# Altium schematic sheet Ethernet_bridge(BOT).SchDoc
size 900 x 699 mm; SheetNumber: 1; SheetTotal: 1; SPICEModelCacheNLVBOJOE: <root> / <DocumentId>NLVBOJOE</DocumentId> / </root>
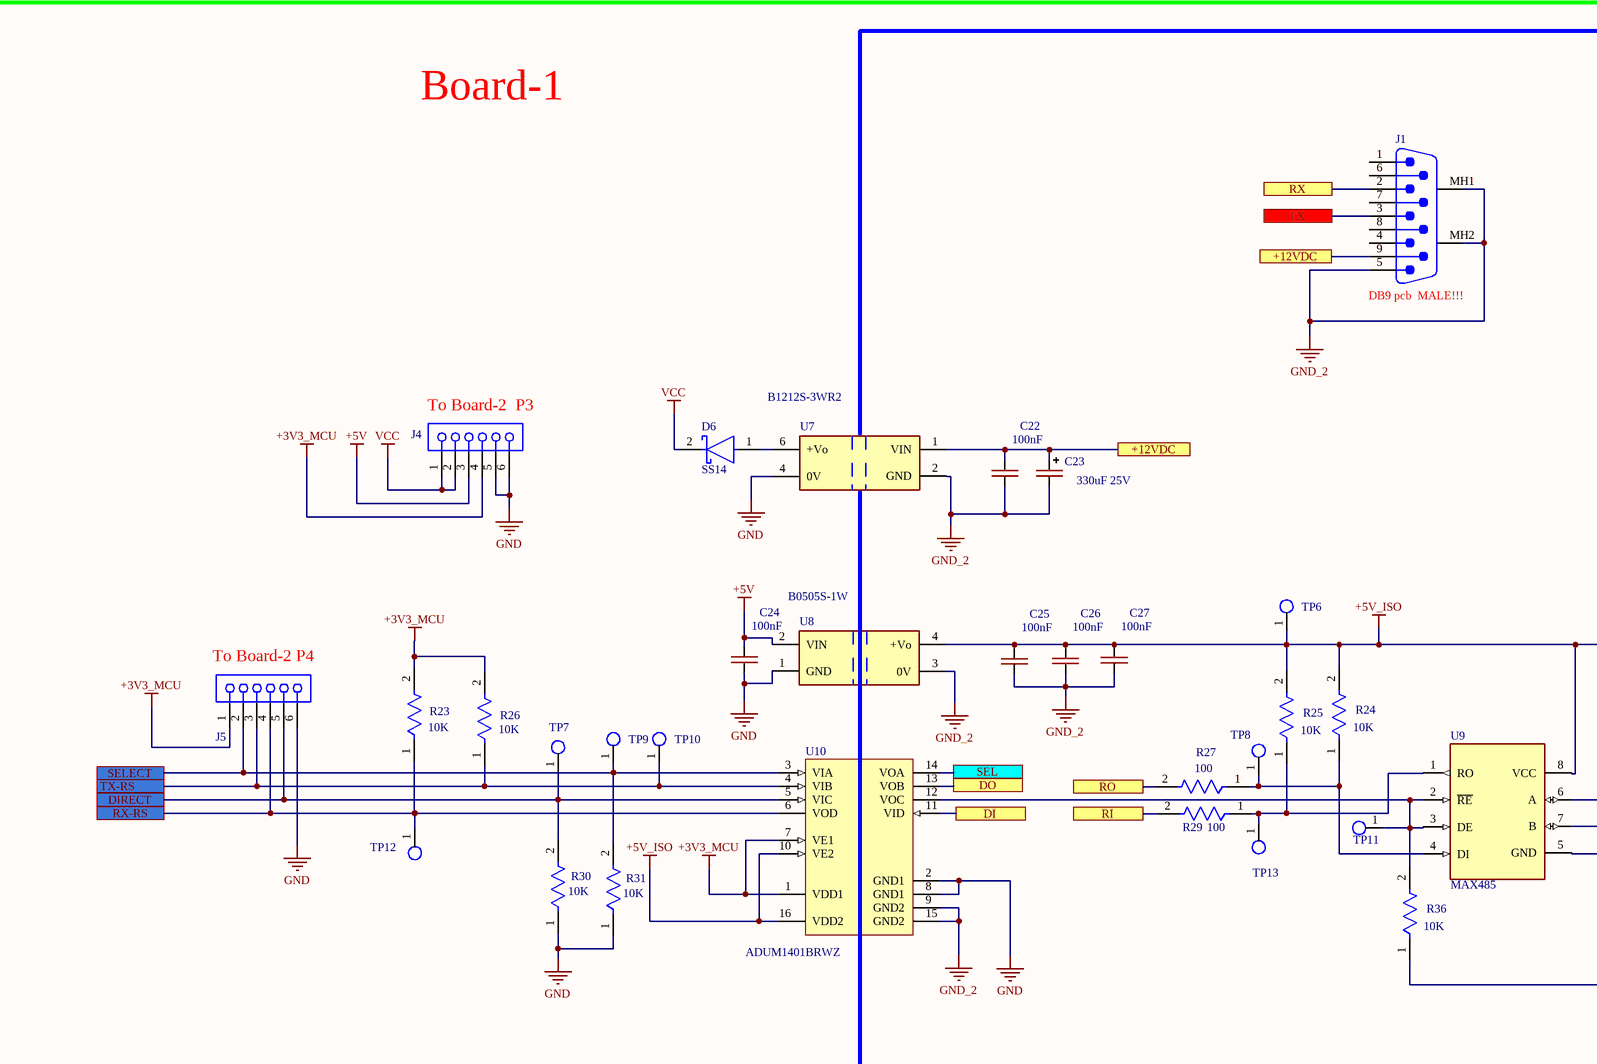
[diagram p0: Ethernet_bridge(BOT).SchDoc, left]
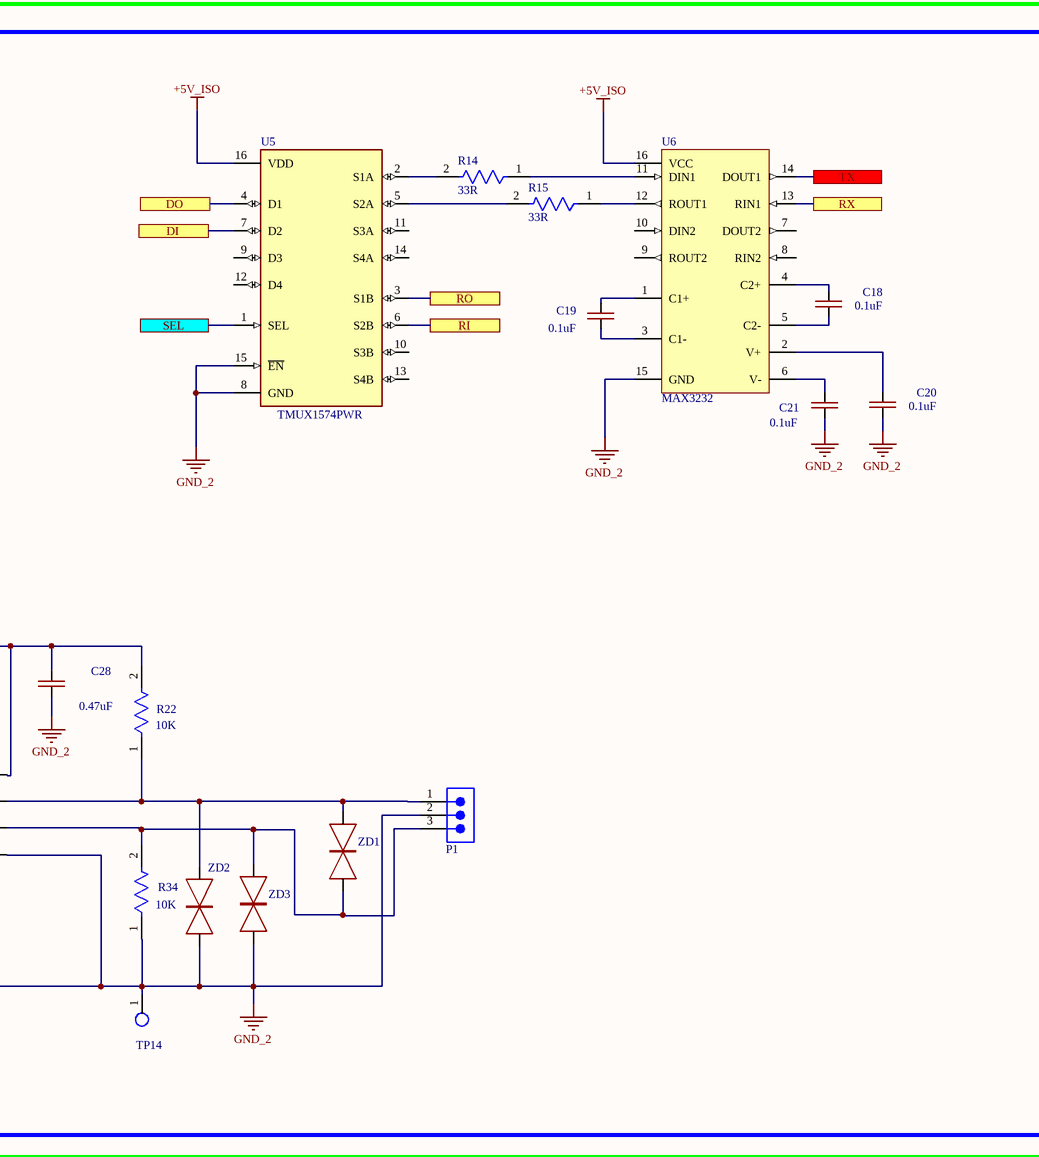
[diagram p1: Ethernet_bridge(BOT).SchDoc, right]

## Parts
C18  0.1uF  [CAP-0603]
C19  0.1uF  [CAP-0603]
C20  0.1uF  [CAP-0603]
C21  0.1uF  [CAP-0603]
C22  100nF  [CAP-0603]
C23  330uF 25V  [CAP_SMD_Size_E]
C24  100nF  [CAP-0603]
C25  100nF  [CAP-0603]
C26  100nF  [CAP-0603]
C27  100nF  [CAP-0603]
C28  0.47uF  [CAP-0805]
D6  SS14  [DO-214-AC]
J1  DB9 pcb  MALE!!!  [DB-9_2]
J4  61300611821  [61300611821]  (value not drawn)
J5  61300611821  [61300611821]  (value not drawn)
P1  691305340003  [691305340003]  (value not drawn)
R14  33R  [RES-0603]
R15  33R  [RES-0603]
R22  10K  [RES-0603]
R23  10K  [RES-0603]
R24  10K  [RES-0603]
R25  10K  [RES-0603]
R26  10K  [RES-0603]
R27  100  [RES-0603]
R29  100  [RES-0603]
R30  10K  [RES-0603]
R31  10K  [RES-0603]
R34  10K  [RES-0603]
R36  10K  [RES-0603]
TP6  Test_Point_PCB  [Test_Point]  (value not drawn)
TP7  Test_Point_PCB  [Test_Point]  (value not drawn)
TP8  Test_Point_PCB  [Test_Point]  (value not drawn)
TP9  Test_Point_PCB  [Test_Point]  (value not drawn)
TP10  Test_Point_PCB  [Test_Point]  (value not drawn)
TP11  Test_Point_PCB  [Test_Point]  (value not drawn)
TP12  Test_Point_PCB  [Test_Point]  (value not drawn)
TP13  (no value)  [Test_Point]
TP14  Test_Point_PCB  [Test_Point]  (value not drawn)
U5  TMUX1574PWR  [TSSOP-16-A]
U6  MAX3232  [SOIC-16-M]
U7  B1212S-3WR2  [B1212S-3WR2]
U8  B0505S-1W  [B0505S-1W]
U9  MAX485  [SOIC-8-MFG]
U10  ADUM1401BRWZ  [ADI-RW-16_M]
ZD1  P6SMB16CA  [DO-214AA]  (value not drawn)
ZD2  P6SMB16CA  [DO-214AA]  (value not drawn)
ZD3  P6SMB16CA  [DO-214AA]  (value not drawn)

## Ports
+12VDC (see Ethernet_bridge(BOT)[3B]), DI (see Ethernet_bridge(BOT)[3C]), DI (see Ethernet_bridge(BOT)[4B]), DIRECT, DO (see Ethernet_bridge(BOT)[3C]), DO (see Ethernet_bridge(BOT)[4B]), RI (see Ethernet_bridge(BOT)[3C]), RI (see Ethernet_bridge(BOT)[4B]), RO (see Ethernet_bridge(BOT)[3C]), RO (see Ethernet_bridge(BOT)[4B]), RX (see Ethernet_bridge(BOT)[3B]), RX (see Ethernet_bridge(BOT)[5B]), RX-RS, SEL (see Ethernet_bridge(BOT)[3C]), SEL (see Ethernet_bridge(BOT)[4B]), SELECT, TX (see Ethernet_bridge(BOT)[3B]), TX (see Ethernet_bridge(BOT)[5B]), TX-RS

## Nets
+3V3_MCU: J4.4 J5.1 R23.2 R26.2 U10.1(VDD1) U10.7(VE1)
+5V: C24.2 J4.3 U8.2(VIN)
+5V_ISO: C25.2 C26.2 C27.2 C28.1 R22.2 R24.2 R25.2 TP6.1(G9) U5.16(VDD) U6.16(VCC) U8.4(+Vo) U9.8(VCC) U10.10(VE2) U10.16(VDD2)
GND: C24.1 J4.5 J4.6 J5.6 R30.1 R31.1 U7.4(0V) U8.1(GND) U10.2(GND1) U10.8(GND1)
GND_2: C20.1 C21.1 C22.1 C23.2(-) C25.1 C26.1 C27.1 C28.2 J1.5 J1.MH1 J1.MH2 P1.2 R34.1 R36.1 TP14.1(G9) U5.8(GND) U5.15(~{EN}) U6.15(GND) U7.2(GND) U8.3(0V) U9.5(GND) U10.9(GND2) U10.15(GND2) ZD2.1(A) ZD3.1(A)
VCC: D6.2(C) J4.1 J4.2
+12VDC: C22.2 C23.1(+) J1.9 U7.1(VIN) ; port +12VDC
DI: U5.7(D2) U10.11(VID) ; port DI
DIRECT: J5.5 R30.2 TP7.1(G9) U10.5(VIC) ; port DIRECT
DO: U5.4(D1) U10.13(VOB) ; port DO
RI: R29.2 U5.6(S2B) ; port RI
RO: R27.2 U5.3(S1B) ; port RO
RX: J1.2 U6.13(RIN1) ; port RX
RX-RS: J5.4 R23.1 TP12.1(G9) U10.6(VOD) ; port RX-RS
SEL: U5.1(SEL) U10.14(VOA) ; port SEL
SELECT: J5.2 R31.2 TP9.1(G9) U10.3(VIA) ; port SELECT
TX: J1.3 U6.14(DOUT1) ; port TX
TX-RS: J5.3 R26.1 TP10.1(G9) U10.4(VIB) ; port TX-RS
NetC18_1: C18.1 U6.5(C2-)
NetC18_2: C18.2 U6.4(C2+)
NetC19_1: C19.1 U6.3(C1-)
NetC19_2: C19.2 U6.1(C1+)
NetC20_2: C20.2 U6.2(V+)
NetC21_2: C21.2 U6.6(V-)
NetD6_1: D6.1(A) U7.6(+Vo)
NetP1_1: P1.1 R22.1 U9.6(A) ZD1.2(A) ZD2.2(A)
NetP1_3: P1.3 R34.2 U9.7(B) ZD1.1(A) ZD3.2(A)
NetR14_1: R14.1 U6.11(DIN1)
NetR14_2: R14.2 U5.2(S1A)
NetR15_1: R15.1 U6.12(ROUT1)
NetR15_2: R15.2 U5.5(S2A)
NetR24_1: R24.1 R27.1 TP8.1(G9) U9.4(DI)
NetR25_1: R25.1 R29.1 TP13.1(G9) U9.1(RO)
NetR36_2: R36.2 TP11.1(G9) U9.2(~{RE}) U9.3(DE) U10.12(VOC)

Not connected (* = marked no-connect by the designer): J1 1 4 6 7 8; U5 9(D3) 10(S3B) 11(S3A) 12(D4) 13(S4B) 14(S4A); U6 7(DOUT2) 8(RIN2) 9(ROUT2) 10(DIN2)

## Notes on the sheet
- Board-1
- (near J4) To Board-2  P3
- (near J5) To Board-2 P4

## Library data of the parts
C18-C22 C24-C28 = CAP-NON-POLAR
C23 = CAP_POL_SMD
J1 = DB9
J4 J5 = 61300611821: WR-PHD Socket Header, THT, Vertical, pitch 2.54mm, 1 Row, 6P; Manufacturer: Wurth Elektronik; Contact Resistance: 20mΩ; Rated Current: 3A; Working Voltage: 250V; Withstanding Voltage: 500V; ComponentLink1Description: Website Link; ComponentLink1URL: https://www.we-online.com/redexpert/article/61300611821?ad; ComponentLink2Description: Datasheet Link; ComponentLink2URL: https://www.we-online.com/redexpert/spec/61300611821?ad; Manufacturer Part Number: 61300611821; Category: Board-to-Board Connectors; Match Code: WR-PHD; Mount: Through Hole; Operating Temperature Max: 125°C; Operating Temperature Min: -40°C; Packaging: Tray; Gender: Socket Header; Number of Pins: 6; Number of Rows: 1; Orientation: Vertical; Pitch: 2.54mm
P1 = 691305340003: WR-TBL Series 3053 Horizontal PCB Header, THT, pitch 3.81mm, 3p; Manufacturer: Wurth Elektronik; Modularity: No; Rated Current: 12A; Working Voltage: 300V; ComponentLink1Description: Website Link; ComponentLink1URL: https://www.we-online.com/redexpert/article/691305340003?ad; ComponentLink2Description: Datasheet Link; ComponentLink2URL: https://www.we-online.com/redexpert/spec/691305340003?ad; Manufacturer Part Number: 691305340003; Category: Terminal Blocks; Match Code: WR-TBL; Mount: Through Hole; Operating Temperature Max: 105°C; Operating Temperature Min: -40°C; Packaging: Box; Application: Pluggable; Number of Pins: 3; Number of Rows: 1; Orientation: Horizontal; Pitch: 3.81mm
R14 R15 R22-R27 R29-R31 R34 R36 = RES-CONST
TP6-TP14 = TP_PCB?: Test_Point
U10 = CMP-0534-00565-1: Quad Channel Digital Isolator, 2.5 KV rms Insulation Rating, 10 Mbps Data Rate, 50 ns Delay, Industrial, 16-pin SOIC (RW-16), Tube; Manufacturer: Analog Devices; Max Data Rate: 10Mbps; ComponentLink2URL: http://www.analog.com/static/imported-files/data_sheets/ADuM1400_1401_1402.pdf; ComponentLink5Description: URL Link2; ComponentLink3URL: http://www.analog.com/static/imported-files/packages/PKG_PDF/SOIC_WIDE%20%28RW%29/RW_16.pdf; DatasheetVersion: Rev. H; ComponentLink2Description: Datasheet; ComponentLink3Description: Package Specification; PartNumber: ADUM1401BRWZ; ComponentLink5URL: Reference Circuit:http://www.analog.com/en/interface-isolation/digital-isolators/adum1401/products/product.html#product-recommendations; Max Operating Temp (degreesC): 125; PackageReference: RW-16; PackageVersion: 032707-B, 03/2007; ComponentLink1Description: Manufacturer URL; Code_JEDEC: MS-013-AA; PackageDescription: 16-Pin Standard Small Outline Package, Body 10.3 x 7.5 mm, Pitch 1.27 mm; Mounting Technology: Surface Mount; ComponentLink1URL: http://www.analog.com/en/index.html; ComponentLink4Description: URL Link1; ComponentLink4URL: Product URL:http://www.analog.com/en/interface-isolation/digital-isolators/adum1401/products/product.html